# Altium project UD3.1-Zogger-Laptop.PrjPCB
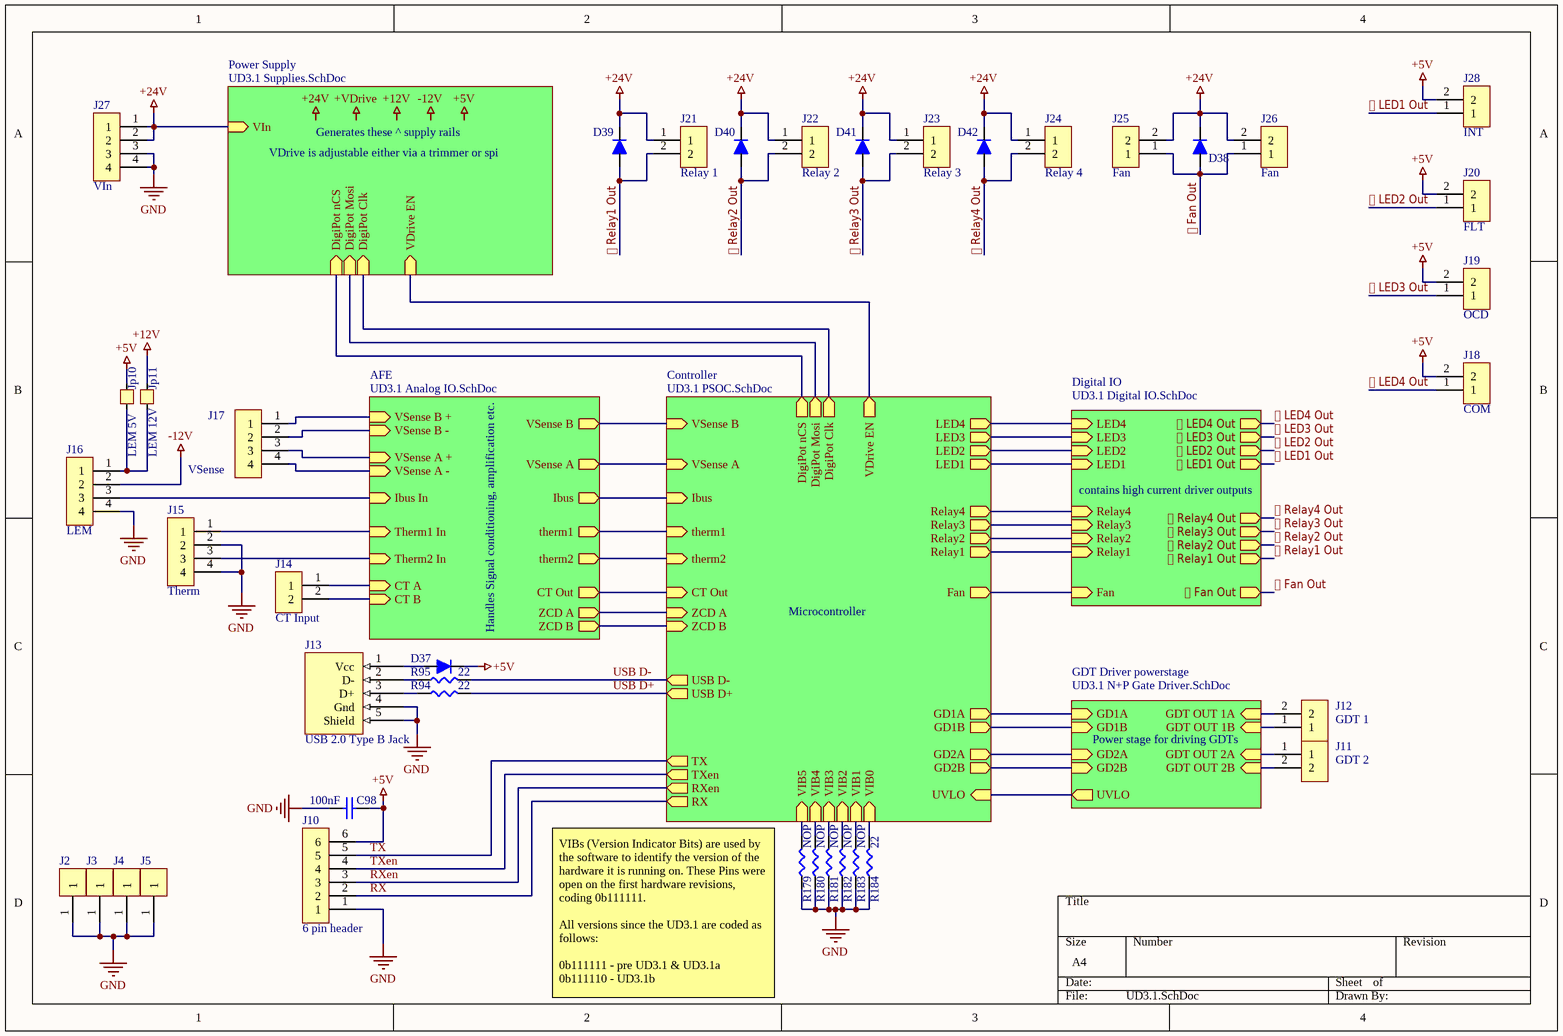
[diagram p0: UD3.1.SchDoc]
ProjectVersion: UD3.1a
6 sheets, 321 parts. Net scope: hierarchical (ports join the sheet entries above them; power ports are global).
Board file: UD3.1.PcbDoc
Sheets:
  UD3.1.SchDoc
    Power Supply = UD3.1 Supplies.SchDoc
    Controller = UD3.1 PSOC.SchDoc
    Digital IO = UD3.1 Digital IO.SchDoc
    GDT Driver powerstage = UD3.1 N+P Gate Driver.SchDoc
    AFE = UD3.1 Analog IO.SchDoc

## Sheet UD3.1.SchDoc
size A4; DocumentNumber: 1; SheetNumber: 1; SheetTotal: 7

### Parts
C98  100nF  [0603]
D37  Schottky 30V 1A  [DO-214]  (value not drawn)
D38  Schottky 30V 1A  [DO-214]  (value not drawn)
D39  Schottky 30V 100mA  [SOD523]  (value not drawn)
D40  Schottky 30V 100mA  [SOD523]  (value not drawn)
D41  Schottky 30V 100mA  [SOD523]  (value not drawn)
D42  Schottky 30V 100mA  [SOD523]  (value not drawn)
J2  GND Pad  [1 Pad M3]  (value not drawn)
J3  GND Pad  [1 Pad M3]  (value not drawn)
J4  GND Pad  [1 Pad M3]  (value not drawn)
J5  GND Pad  [1 Pad M3]  (value not drawn)
J10  6 pin header  [6 KK254 / KF2510]
J11  GDT 2  [2 KK254 / KF2510]
J12  GDT 1  [2 KK254 / KF2510]
J13  USB 2.0 Type B Jack  [USB 2.0 Type B Vertical]
J14  CT Input  [2 KK254 / KF2510]
J15  Therm  [4 KK254 / KF2510]
J16  LEM  [4 KK254 / KF2510]
J17  VSense  [4 KK254 / KF2510]
J18  COM  [2 KK254 / KF2510]
J19  OCD  [2 KK254 / KF2510]
J20  FLT  [2 KK254 / KF2510]
J21  Relay 1  [2 KK254 / KF2510]
J22  Relay 2  [2 KK254 / KF2510]
J23  Relay 3  [2 KK254 / KF2510]
J24  Relay 4  [2 KK254 / KF2510]
J25  Fan  [2 KK254 / KF2510]
J26  Fan  [2 screw terminal vertical]
J27  VIn  [4 KK254 / KF2510]
J28  INT  [2 KK254 / KF2510]
Jp10  LEM 5V  [PCB Jumper NO]
Jp11  LEM 12V  [PCB Jumper NO]
R94  22  [0603]
R95  22  [0603]
R179  NOP  [0603]
R180  NOP  [0603]
R181  NOP  [0603]
R182  NOP  [0603]
R183  NOP  [0603]
R184  22  [0603]

### Sub-sheets
AFE = UD3.1 Analog IO.SchDoc: VSense B + (in), VSense B - (in), VSense A + (in), VSense A - (in), CT A (in), CT B (in), ZCD A (out), ZCD B (out), CT Out (out), Ibus In (in), Ibus (out), Therm1 In (in), therm1 (out), Therm2 In (in), therm2 (out), VSense A (out), VSense B (out)
Controller = UD3.1 PSOC.SchDoc: LED4 (out), LED1 (out), LED2 (out), LED3 (out), Relay1 (out), Relay3 (out), Relay2 (out), Relay4 (out), Fan (out), ZCD A (in), ZCD B (in), CT Out (in), Ibus (in), therm1 (in), therm2 (in), VSense A (in), VSense B (in), DigiPot nCS (out), DigiPot Mosi (out), DigiPot Clk (out), VDrive EN (out), GD1A (out), GD1B (out), GD2A (out), GD2B (out), UVLO (in), USB D- (out), USB D+ (out), RX (out), RXen (out), TXen (out), TX (out), VIB0 (in), VIB1 (in), VIB2 (in), VIB3 (in), VIB4 (in), VIB5 (in)
Digital IO = UD3.1 Digital IO.SchDoc: LED4 (in), ⎐ LED4 Out (out), LED1 (in), LED2 (in), LED3 (in), ⎐ LED3 Out (out), ⎐ LED2 Out (out), ⎐ LED1 Out (out), ⎐ Relay3 Out (out), Relay1 (in), Relay2 (in), Relay3 (in), Relay4 (in), ⎐ Relay1 Out (out), ⎐ Relay2 Out (out), ⎐ Relay4 Out (out), Fan (in), ⎐ Fan Out (out)
GDT Driver powerstage = UD3.1 N+P Gate Driver.SchDoc: GD1A (in), GD1B (in), GD2A (in), GD2B (in), GDT OUT 1A (in), GDT OUT 1B (in), GDT OUT 2A (in), GDT OUT 2B (in), UVLO (out)
Power Supply = UD3.1 Supplies.SchDoc: VIn (in), DigiPot nCS (in), DigiPot Mosi (in), DigiPot Clk (in), VDrive EN (in)

### Nets
+5V: C98.1 D37.2 J10.6 J18.2 J19.2 J20.2 J28.2 Jp10.2
+12V: Jp11.2
+24V: D38.2 D39.2 D40.2 D41.2 D42.2 J21.1 J22.1 J23.1 J24.1 J25.2 J26.2 J27.1 J27.2 ; sheet Power Supply/VIn
-12V: J16.2
GND: C98.2 J2.1 J3.1 J4.1 J5.1 J10.1 J13.4(Gnd) J13.5(Shield) J15.2 J15.4 J16.4 J27.3 J27.4 R179.2 R180.2 R181.2 R182.2 R183.2 R184.2
CTA: J14.1 ; sheet AFE/CT A
CTB: J14.2 ; sheet AFE/CT B
CTout: sheet Controller/CT Out, sheet AFE/CT Out
DigiPot Clk: sheet Power Supply/DigiPot Clk, sheet Controller/DigiPot Clk
DigiPot Mosi: sheet Power Supply/DigiPot Mosi, sheet Controller/DigiPot Mosi
DigiPot nCS: sheet Power Supply/DigiPot nCS, sheet Controller/DigiPot nCS
E3.9: sheet Power Supply/VDrive EN, sheet Controller/VDrive EN
FAN: sheet Controller/Fan, sheet Digital IO/Fan
GD1A: sheet Controller/GD1A, sheet GDT Driver powerstage/GD1A
GD1B: sheet Controller/GD1B, sheet GDT Driver powerstage/GD1B
GD2A: sheet Controller/GD2A, sheet GDT Driver powerstage/GD2A
GD2B: sheet Controller/GD2B, sheet GDT Driver powerstage/GD2B
Ibus: sheet Controller/Ibus, sheet AFE/Ibus
LED1: sheet Controller/LED1, sheet Digital IO/LED1
LED2: sheet Controller/LED2, sheet Digital IO/LED2
LED3: sheet Controller/LED3, sheet Digital IO/LED3
LED4: sheet Controller/LED4, sheet Digital IO/LED4
Relay1: sheet Controller/Relay1, sheet Digital IO/Relay1
Relay2: sheet Controller/Relay2, sheet Digital IO/Relay2
Relay3: sheet Controller/Relay3, sheet Digital IO/Relay3
Relay4: sheet Controller/Relay4, sheet Digital IO/Relay4
RX: J10.2 ; sheet Controller/RX
RXen: J10.3 ; sheet Controller/RXen
therm1: sheet Controller/therm1, sheet AFE/therm1
therm2: sheet Controller/therm2, sheet AFE/therm2
TX: J10.5 ; sheet Controller/TX
TXen: J10.4 ; sheet Controller/TXen
USB D+: R94.1 ; sheet Controller/USB D+
USB D-: R95.1 ; sheet Controller/USB D-
UVLO: sheet Controller/UVLO, sheet GDT Driver powerstage/UVLO
VSense A: sheet Controller/VSense A, sheet AFE/VSense A
VSense B: sheet Controller/VSense B, sheet AFE/VSense B
ZCDA: sheet Controller/ZCD A, sheet AFE/ZCD A
ZCDB: sheet Controller/ZCD B, sheet AFE/ZCD B
⎐ Fan Out: D38.1 J25.1 J26.1 ; sheet Digital IO/⎐ Fan Out
⎐ LED1 Out: J28.1 ; sheet Digital IO/⎐ LED1 Out
⎐ LED2 Out: J20.1 ; sheet Digital IO/⎐ LED2 Out
⎐ LED3 Out: J19.1 ; sheet Digital IO/⎐ LED3 Out
⎐ LED4 Out: J18.1 ; sheet Digital IO/⎐ LED4 Out
⎐ Relay1 Out: D39.1 J21.2 ; sheet Digital IO/⎐ Relay1 Out  [project net Relay1 Out]
⎐ Relay2 Out: D40.1 J22.2 ; sheet Digital IO/⎐ Relay2 Out  [project net Relay2 Out]
⎐ Relay3 Out: D41.1 J23.2 ; sheet Digital IO/⎐ Relay3 Out  [project net Relay3 Out]
⎐ Relay4 Out: D42.1 J24.2 ; sheet Digital IO/⎐ Relay4 Out  [project net Relay4 Out]
NetC84_1: J17.4 ; sheet AFE/VSense A -
NetC85_2: J17.3 ; sheet AFE/VSense A +
NetC88_2: J15.3 ; sheet AFE/Therm2 In
NetC92_2: J17.1 ; sheet AFE/VSense B +
NetC94_2: J17.2 ; sheet AFE/VSense B -
NetC95_2: J15.1 ; sheet AFE/Therm1 In
NetC100_2: J11.2 ; sheet GDT Driver powerstage/GDT OUT 2B
NetC102_2: J11.1 ; sheet GDT Driver powerstage/GDT OUT 2A
NetC116_2: J12.1 ; sheet GDT Driver powerstage/GDT OUT 1B
NetC118_2: J12.2 ; sheet GDT Driver powerstage/GDT OUT 1A
NetD37_1: D37.1 J13.1(Vcc)
NetJ13_2: J13.2(D-) R95.2
NetJ13_3: J13.3(D+) R94.2
NetJ16_1: J16.1 Jp10.1 Jp11.1
NetJ16_3: J16.3 ; sheet AFE/Ibus In
NetR179_1: R179.1 ; sheet Controller/VIB5
NetR180_1: R180.1 ; sheet Controller/VIB4
NetR181_1: R181.1 ; sheet Controller/VIB3
NetR182_1: R182.1 ; sheet Controller/VIB2
NetR183_1: R183.1 ; sheet Controller/VIB1
NetR184_1: R184.1 ; sheet Controller/VIB0

### Notes on the sheet
- VDrive is adjustable either via a trimmer or spi
- Generates these ^ supply rails
- contains high current driver outputs
- Handles Signal conditioning, amplification etc.
- Microcontroller
- Power stage for driving GDTs
- VIBs (Version Indicator Bits) are used by the software to identify the version of the hardware it is running on. These Pins were open on the first hardware revisions, coding 0b111111.
  All versions since the UD3.1 are coded as follows:
  0b111111 - pre UD3.1 & UD3.1a
  0b111110 - UD3.1b
- Labels drawn without touching a wire or pin: +5V, +12V, +24V, +VDrive, -12V

### Library data of the parts
C98 = Cap
D37-D42 = Diode: Cmon its a diode what more do I need to say?; pin to pad: 1>2 2>1; Supplier 1: Digi-Key; Supplier Part Number 1: MBR10100GOS-ND; Supplier 2: Digi-Key; Supplier Part Number 2: 1655-1504-1-ND
J2-J5 = 1 Header
J10 = 6 header
J11 J12 J14 J18-J25 J28 = 2 header
J13 = USB 2.0 Type B
J15-J17 J27 = 4 header
J26 = 2 screw terminal
Jp10 Jp11 = Jumper
R94 R95 R179-R184 = Resistor

## Sheet UD3.1 Supplies.SchDoc
size A4; DocumentNumber: 2; SheetNumber: 2; SheetTotal: 7
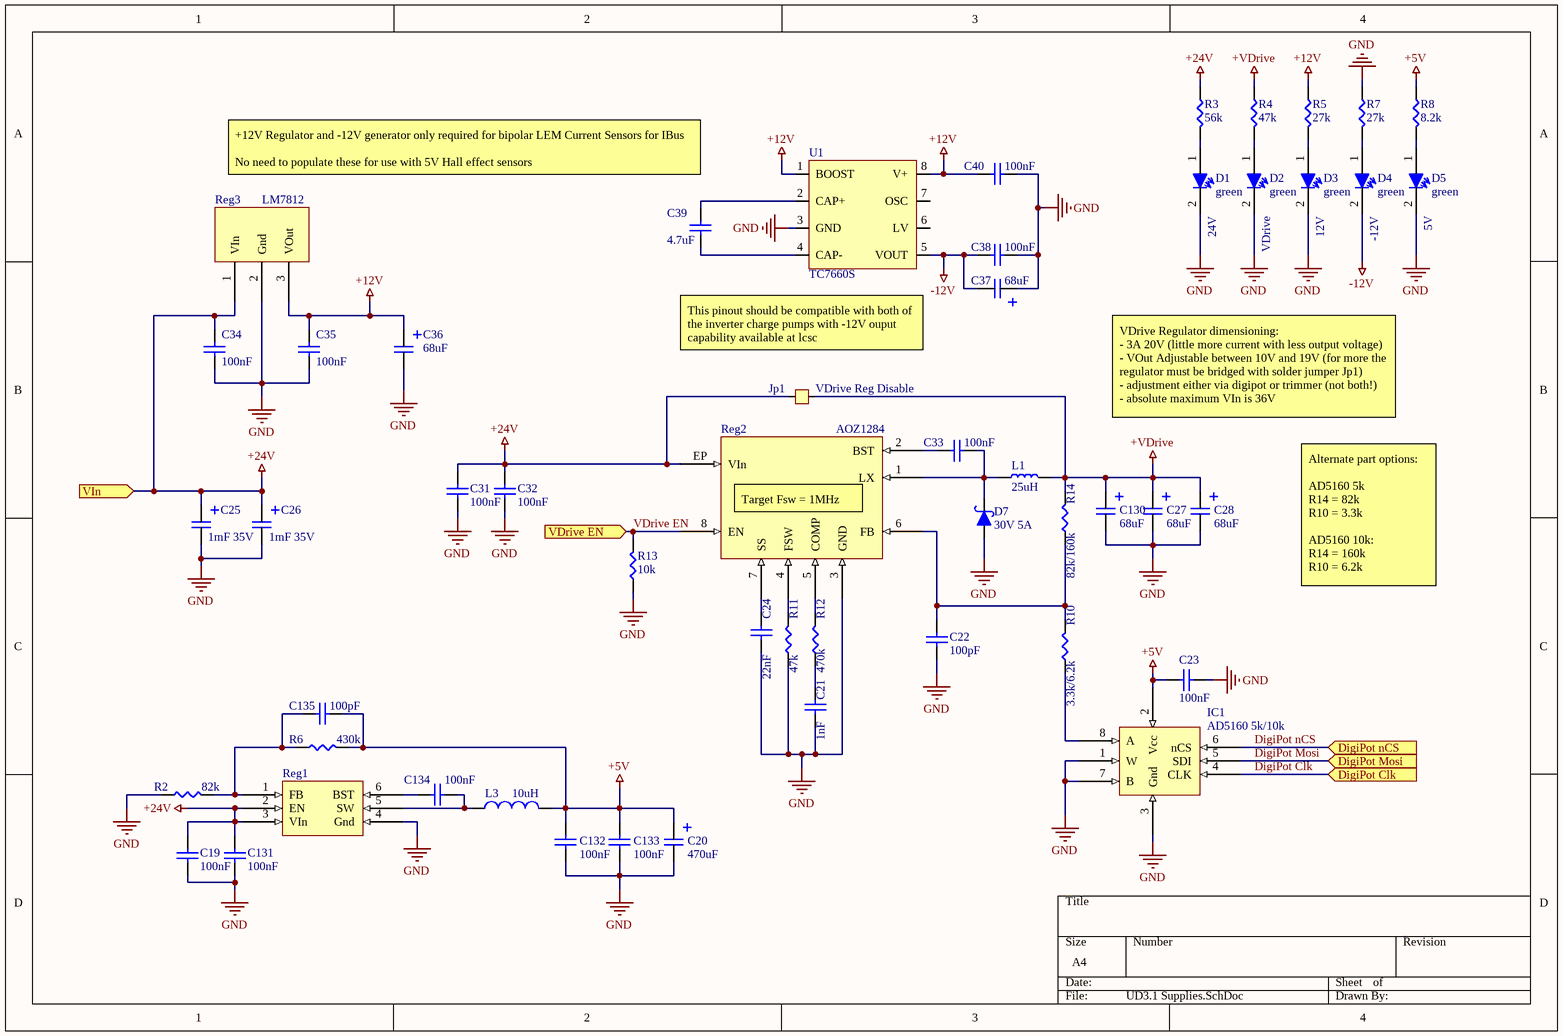
[diagram p1: UD3.1 Supplies.SchDoc]

### Parts
C19  100nF  [0603]
C20  470uF  [Elko 6,3 x 11 x 2,5]
C21  1nF  [0603]
C22  100pF  [0603]
C23  100nF  [0603]
C24  22nF  [0603]
C25  1mF 35V  [Elko 13 x 25 x 5]
C26  1mF 35V  [Elko 13 x 25 x 5]
C27  68uF  [Elko 6,3 x 11 x 2,5]
C28  68uF  [Elko 6,3 x 11 x 2,5]
C31  100nF  [0603]
C32  100nF  [0603]
C33  100nF  [0603]
C34  100nF  [0603]
C35  100nF  [0603]
C36  68uF  [Elko 6,3 x 11 x 2,5]
C37  68uF  [Elko 6,3 x 11 x 2,5]
C38  100nF  [0603]
C39  4.7uF  [0603]
C40  100nF  [0603]
C130  68uF  [Elko 6,3 x 11 x 2,5]
C131  100nF  [0603]
C132  100nF  [0603]
C133  100nF  [0603]
C134  100nF  [0603]
C135  100pF  [0603]
D1  green  [1206 Reverse Mount]
D2  green  [1206 Reverse Mount]
D3  green  [1206 Reverse Mount]
D4  green  [1206 Reverse Mount]
D5  green  [1206 Reverse Mount]
D7  30V 5A  [DO-214]
IC1  AD5160 5k/10k  [Sot 23-8]
Jp1  VDrive Reg Disable  [PCB Jumper NO]
L1  25uH  [Inductor 11x11mm]
L3  10uH  [1008]
R2  82k  [0603]
R3  56k  [0603]
R4  47k  [0603]
R5  27k  [0603]
R6  430k  [0603]
R7  27k  [0603]
R8  8.2k  [0603]
R10  3.3k/6.2k  [0603]
R11  47k  [0603]
R12  470k  [0603]
R13  10k  [0603]
R14  82k/160k  [0603]
Reg1  Buck regulator  [TSOT26]  (value not drawn)
Reg2  AOZ1284  [SOIC8 EXPOSED]
Reg3  LM7812  [TO252 DPAk]
U1  TC7660S  [SOIC8]

### Ports
DigiPot Clk (in), DigiPot Mosi (in), DigiPot nCS (in), VDrive EN (in), VIn (in)

### Nets
+5V: C20.1 C23.2 C132.1 C133.1 C135.1 IC1.2(Vcc) L3.2 R6.2 R8.1
+12V: C35.2 C36.1 C40.2 R5.1 Reg3.3(VOut) U1.1(BOOST) U1.8(V+)
+24V: C19.2 C25.1 C26.1 C31.2 C32.2 C34.2 C131.1 Jp1.1 R3.1 Reg1.2(EN) Reg1.3(VIn) Reg2.EP(VIn) Reg3.1(VIn) ; port VIn
+VDrive: C27.1 C28.1 C130.1 Jp1.2 L1.2 R4.1 R14.2
-12V: C37.2 C38.2 D4.2 U1.5(VOUT)
GND: C19.1 C20.2 C21.1 C22.2 C23.1 C24.1 C25.2 C26.2 C27.2 C28.2 C31.1 C32.1 C34.1 C35.1 C36.2 C37.1 C38.1 C40.1 C130.2 C131.2 C132.2 C133.2 D1.2 D2.2 D3.2 D5.2 D7.1 IC1.1(W) IC1.3(Gnd) IC1.7(B) R2.1 R7.1 R11.1 R13.1 Reg1.4(Gnd) Reg2.3(GND) Reg3.2(Gnd) U1.3(GND)
DigiPot Clk: IC1.4(CLK) ; port DigiPot Clk
DigiPot Mosi: IC1.5(SDI) ; port DigiPot Mosi
DigiPot nCS: IC1.6(nCS) ; port DigiPot nCS
VDrive EN: R13.2 Reg2.8(EN) ; port VDrive EN  [project net E3.9]
NetC21_2: C21.2 R12.1
NetC22_1: C22.1 R10.2 R14.1 Reg2.6(FB)
NetC24_2: C24.2 Reg2.7(SS)
NetC33_1: C33.1 D7.2 L1.1 Reg2.1(LX)
NetC33_2: C33.2 Reg2.2(BST)
NetC39_1: C39.1 U1.2(CAP+)
NetC39_2: C39.2 U1.4(CAP-)
NetC134_1: C134.1 Reg1.6(BST)
NetC134_2: C134.2 L3.1 Reg1.5(SW)
NetC135_2: C135.2 R2.2 R6.1 Reg1.1(FB)
NetD1_1: D1.1 R3.2
NetD2_1: D2.1 R4.2
NetD3_1: D3.1 R5.2
NetD4_1: D4.1 R7.2
NetD5_1: D5.1 R8.2
NetIC1_8: IC1.8(A) R10.1
NetR11_2: R11.2 Reg2.4(FSW)
NetR12_2: R12.2 Reg2.5(COMP)

Not connected (* = marked no-connect by the designer): U1 6(LV) 7(OSC)

### Notes on the sheet
- (near C39) +12V Regulator and -12V generator only required for bipolar LEM Current Sensors for IBus
  No need to populate these for use with 5V Hall effect sensors
- 24V
- VDrive
- 12V
- -12V
- (near D5) 5V
- This pinout should be compatible with both of the inverter charge pumps with -12V ouput capability available at lcsc
- VDrive Regulator dimensioning:
  - 3A 20V (little more current with less output voltage)
  - VOut Adjustable between 10V and 19V (for more the regulator must be bridged with solder jumper Jp1)
  - adjustment either via digipot or trimmer (not both!)
  - absolute maximum VIn is 36V
- (near Reg2) Target Fsw = 1MHz
- Alternate part options:
  AD5160 5k
  R14 = 82k
  R10 = 3.3k
  AD5160 10k:
  R14 = 160k
  R10 = 6.2k

### Library data of the parts
C19 C21-C24 C31-C35 C38-C40 C131-C135 = Cap
  C19 C131-C135: Supplier 1: Digi-Key; Supplier 2: Digi-Key; Supplier 3: Digi-Key; Supplier Part Number 1: 1276-2044-1-ND; Supplier Part Number 2: 1276-1018-1-ND; Supplier Part Number 3: 1276-1182-1-ND; Supplier 4: Digi-Key; Supplier 5: Digi-Key; Supplier 6: Digi-Key; Supplier 7: Digi-Key; Supplier 8: Digi-Key; Supplier 9: Digi-Key; Supplier Part Number 4: 1276-1009-1-ND; Supplier Part Number 5: 1276-1098-1-ND; Supplier Part Number 6: 1276-1119-1-ND; Supplier Part Number 7: 490-12737-1-ND; Supplier Part Number 9: 587-1249-1-ND; Supplier Part Number 8: 1276-1183-1-ND; Supplier 10: Digi-Key; Supplier 11: Digi-Key; Supplier 12: Digi-Key; Supplier 13: Digi-Key; Supplier Part Number 10: 1276-CL10B104KB8NNNLCT-ND; Supplier Part Number 11: 399-1085-1-ND; Supplier Part Number 13: 587-2985-1-ND; Supplier Part Number 12: 1276-1021-1-ND; Supplier 14: Digi-Key; Supplier 15: Digi-Key; Supplier 16: Digi-Key; Supplier 17: Digi-Key; Supplier 18: Digi-Key; Supplier 19: Digi-Key; Supplier Part Number 14: 490-14603-1-ND; Supplier Part Number 15: 311-3700-1-ND; Supplier Part Number 16: 311-1042-1-ND; Supplier Part Number 17: 311-1415-1-ND; Supplier Part Number 19: 587-4321-1-ND; Supplier Part Number 18: 1276-1907-1-ND; Supplier 20: Digi-Key; Supplier 21: Digi-Key; Supplier 22: Digi-Key; Supplier Part Number 20: 1276-6767-1-ND; Supplier Part Number 21: 1276-7060-1-ND; Supplier Part Number 22: 311-1084-1-ND
C20 C25-C28 C36 C37 C130 = Cap Polar: Supplier 1: Digi-Key; Supplier Part Number 1: 478-9181-1-ND; Supplier 2: Digi-Key; Supplier 3: Digi-Key; Supplier Part Number 2: 478-9173-1-ND; Supplier Part Number 3: 493-11037-ND; Supplier 4: Digi-Key; Supplier 5: Digi-Key; Supplier Part Number 4: PCE3462CT-ND; Supplier Part Number 5: 399-18864-1-ND; Supplier 6: Digi-Key; Supplier Part Number 6: 399-10512-1-ND; Supplier 7: Digi-Key; Supplier Part Number 7: 399-15746-ND; Supplier 8: Digi-Key; Supplier Part Number 8: 1189-3752-1-ND
D1-D5 = LED: Diode, but it lights up; Supplier 1: Digi-Key; Supplier 2: Digi-Key; Supplier 3: Digi-Key; Supplier 4: Digi-Key; Supplier Part Number 1: 732-4979-1-ND; Supplier Part Number 2: 732-4971-1-ND; Supplier Part Number 3: 732-4966-1-ND; Supplier Part Number 4: 732-4981-1-ND
D7 = Diode Schottky: pin to pad: 1>2 2>1; Supplier 1: Digi-Key; Supplier Part Number 1: FSV12100VCT-ND
IC1 = AD5160: DigiPot 8bit
Jp1 = Jumper
L1 = Inductor High Power: Supplier 1: Digi-Key; Supplier Part Number 1: 541-1253-1-ND; Supplier 2: Digi-Key; Supplier Part Number 2: SRP1265A-1R0MCT-ND; Supplier 3: Digi-Key; Supplier Part Number 3: 732-4237-1-ND
L3 = Inductor: Supplier 1: Digi-Key; Supplier 2: Digi-Key; Supplier Part Number 1: 541-1250-1-ND; Supplier Part Number 2: 541-1253-1-ND; Supplier 3: Digi-Key; Supplier 4: Digi-Key; Supplier Part Number 3: SRN6028-3R9MCT-ND; Supplier Part Number 4: SRN6028-4R7MCT-ND; Supplier 5: Digi-Key; Supplier 6: Digi-Key; Supplier 7: Digi-Key; Supplier 8: Digi-Key; Supplier 9: Digi-Key; Supplier 10: Digi-Key; Supplier 11: Digi-Key; Supplier Part Number 5: 490-10563-1-ND; Supplier Part Number 6: 1276-6932-1-ND; Supplier Part Number 7: 587-2042-1-ND; Supplier Part Number 8: 535-12790-1-ND; Supplier Part Number 9: SRP1265A-1R0MCT-ND; Supplier Part Number 10: SRP1770TA-5R6MCT-ND; Supplier Part Number 11: SRN6028-100MCT-ND
R2-R8 R10-R14 = Resistor
Reg1 = AP6320: Supplier 1: Digi-Key; Supplier Part Number 1: AP63203WU-7DICT-ND; Supplier 2: Digi-Key; Supplier Part Number 2: AP63200WU-7DICT-ND; Supplier 3: Digi-Key; Supplier Part Number 3: AP63201WU-7DICT-ND
Reg2 = AOZ1284: Buck Regulator, Internal Switch 4A
Reg3 = lm78xx: positive voltage regulator

## Sheet UD3.1 PSOC.SchDoc
size A4; DocumentNumber: 3; SheetNumber: 3; SheetTotal: 7; PageSetup: Record=PageOptions|CenterHorizontal=True|CenterVertical=True|PrintScale=0.54|XCorrection=1.00|YCorrection=1.00|PrintKind=0|BorderSize=5000000|LeftOffset=0|BottomOffset=0|Orientation=2|PaperLength=1000|PaperWidth=1000|Scale=100|PaperSource=7|PrintQuality=-4|MediaType=1|DitherType=10|PaperKind=Letter|PrintScaleMode=1
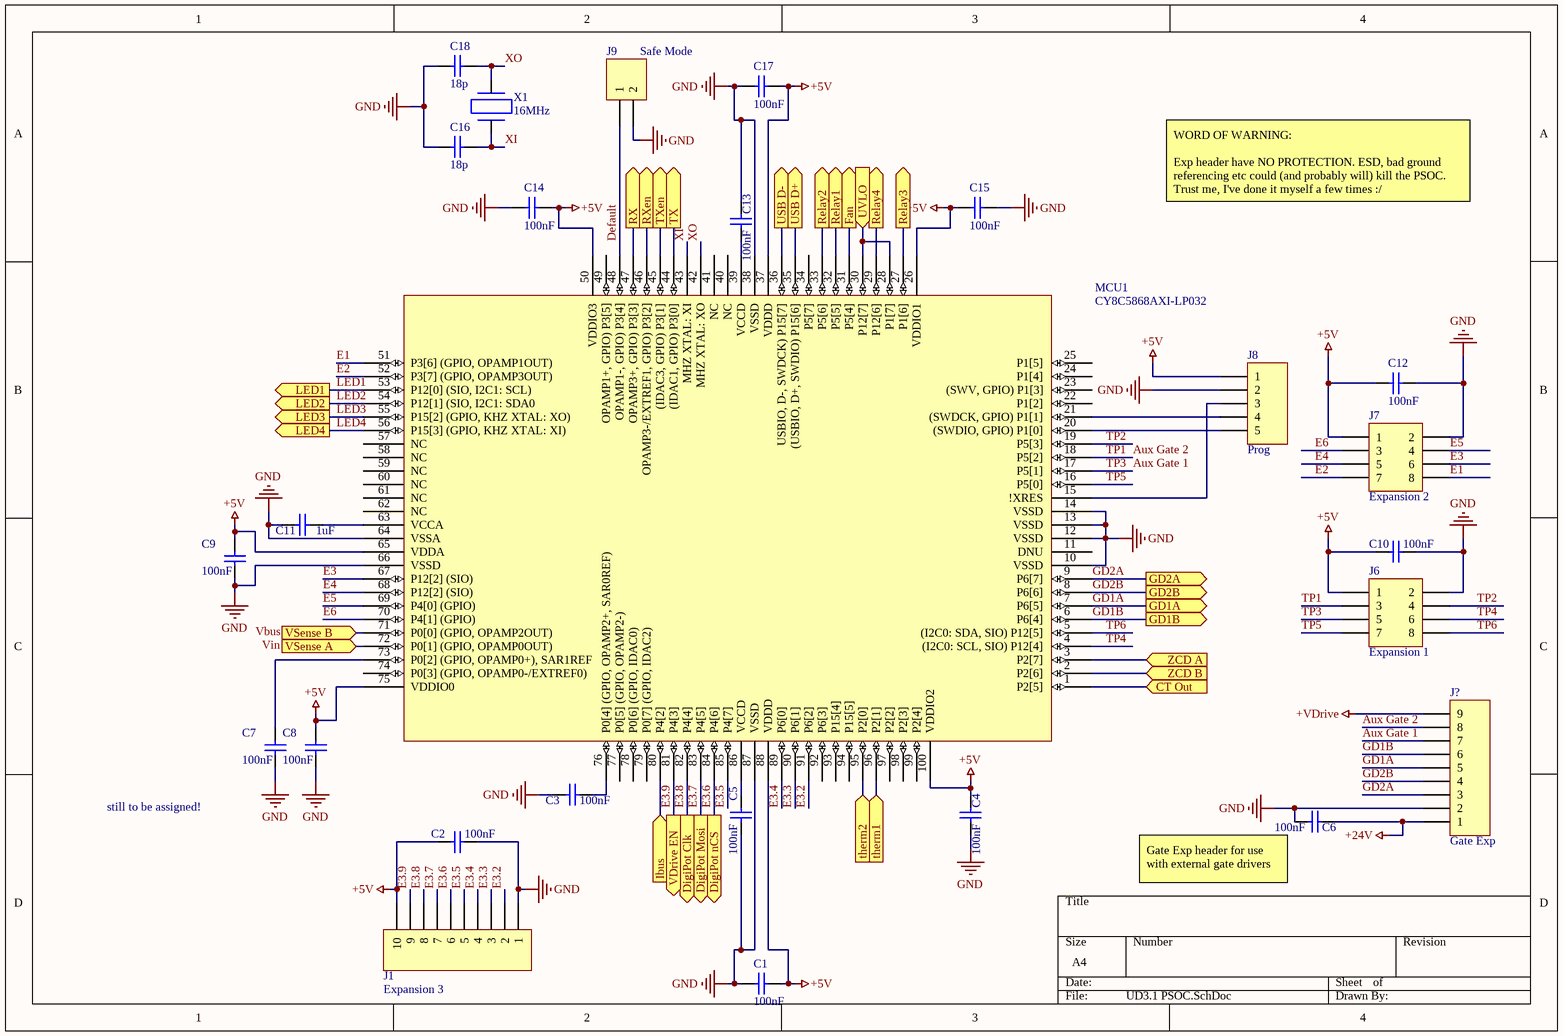
[diagram p2: UD3.1 PSOC.SchDoc]

### Parts
C1  100nF  [0603]
C2  100nF  [0603]
C3  100nF  [0603]
C4  100nF  [0603]
C5  100nF  [0603]
C6  100nF  [0805]
C7  100nF  [0603]
C8  100nF  [0603]
C9  100nF  [0603]
C10  100nF  [0603]
C11  1uF  [0603]
C12  100nF  [0603]
C13  100nF  [0603]
C14  100nF  [0603]
C15  100nF  [0603]
C16  18p  [0603]
C17  100nF  [0603]
C18  18p  [0603]
J1  Expansion 3  [HDR1X10]
J6  Expansion 1  [HDR2X4]
J7  Expansion 2  [HDR2X4]
J8  Prog  [HDR1X5]
J9  Safe Mode  [HDR1X2]
J?  Gate Exp  [HDR1X9]
MCU1  CY8C5868AXI-LP032  [TQFP 100]
X1  16MHz  [ECS-3225MV Oscillator]

### Ports
CT Out (in), DigiPot Clk (out), DigiPot Mosi (out), DigiPot nCS (out), Fan (out), GD1A (out), GD1B (out), GD2A (out), GD2B (out), Ibus (in), LED1 (out), LED2 (out), LED3 (out), LED4 (out), Relay1 (out), Relay2 (out), Relay3 (out), Relay4 (out), RX (out), RXen (out), therm1 (in), therm2 (in), TX (out), TXen (out), USB D+ (out), USB D- (out), UVLO (in), VDrive EN (out), VSense A (in), VSense B (in), ZCD A (in), ZCD B (in)

### Nets
+5V: C1.2 C2.1 C4.2 C8.2 C9.2 C10.1 C12.2 C14.2 C15.2 C17.2 J1.10 J6.1 J7.1 J8.1 MCU1.26(VDDIO1) MCU1.37(VDDD) MCU1.50(VDDIO3) MCU1.65(VDDA) MCU1.75(VDDIO0) MCU1.88(VDDD) MCU1.100(VDDIO2)
+24V: C6.2 J?.1
+VDrive: J?.9
GND: C1.1 C2.2 C3.1 C4.1 C5.1 C6.1 C7.1 C8.1 C9.1 C10.2 C11.1 C12.1 C13.1 C14.1 C15.1 C16.2 C17.1 C18.2 J1.1 J6.2 J7.2 J8.2 J9.2 J?.2 MCU1.10(VSSD) MCU1.12(VSSD) MCU1.13(VSSD) MCU1.14(VSSD) MCU1.38(VSSD) MCU1.64(VSSA) MCU1.66(VSSD) MCU1.87(VSSD)
Aux Gate 1: J6.5 J?.7 MCU1.17(P5[1])  [also labelled TP3]
Aux Gate 2: J6.3 J?.8 MCU1.18(P5[2])  [also labelled TP1]
CTout: MCU1.1(P2[5]) ; port CT Out
Default: J9.1 MCU1.48(OPAMP1-,_GPIO)_P3[4])
E1: J7.8 MCU1.51(P3[6]_(GPIO,_OPAMP1OUT))
E2: J7.7 MCU1.52(P3[7]_(GPIO,_OPAMP3OUT))
E3: J7.6 MCU1.67(P12[2]_(SIO))
E3.2: J1.2 MCU1.91(P6[2])
E3.3: J1.3 MCU1.90(P6[1])
E3.4: J1.4 MCU1.89(P6[0])
E3.5: J1.5 MCU1.85(P4[7])
E3.6: J1.6 MCU1.84(P4[6]) ; port DigiPot nCS  [project net DigiPot nCS]
E3.7: J1.7 MCU1.83(P4[5]) ; port DigiPot Mosi  [project net DigiPot Mosi]
E3.8: J1.8 MCU1.82(P4[4]) ; port DigiPot Clk  [project net DigiPot Clk]
E3.9: J1.9 MCU1.81(P4[3]) ; port VDrive EN
E4: J7.5 MCU1.68(P12[2]_(SIO))
E5: J7.4 MCU1.69(P4[0]_(GPIO))
E6: J7.3 MCU1.70(P4[1]_(GPIO))
FAN: MCU1.31(P5[4]) ; port Fan
GD1A: J?.5 MCU1.7(P6[5]) ; port GD1A
GD1B: J?.6 MCU1.6(P6[4]) ; port GD1B
GD2A: J?.3 MCU1.9(P6[7]) ; port GD2A
GD2B: J?.4 MCU1.8(P6[6]) ; port GD2B
Ibus: MCU1.80(P4[2]) ; port Ibus
LED1: MCU1.53(P12[0]_(SIO,_I2C1:_SCL)) ; port LED1
LED2: MCU1.54(P12[1]_(SIO,_I2C1:_SDA0) ; port LED2
LED3: MCU1.55(P15[2]_(GPIO,_KHZ_XTAL:_XO)) ; port LED3
LED4: MCU1.56(P15[3]_(GPIO,_KHZ_XTAL:_XI)) ; port LED4
Relay1: MCU1.32(P5[5]) ; port Relay1
Relay2: MCU1.33(P5[6]) ; port Relay2
Relay3: MCU1.27(P1[6]) ; port Relay3
Relay4: MCU1.29(P12[6]) ; port Relay4
RX: MCU1.47(OPAMP3+,_GPIO)_P3[3]) ; port RX
RXen: MCU1.46(OPAMP3-/EXTREF1,_GPIO)_P3[2]) ; port RXen
therm1: MCU1.96(P2[1]) ; port therm1
therm2: MCU1.95(P2[0]) ; port therm2
TP2: J6.4 MCU1.19(P5[3])
TP4: J6.6 MCU1.4((I2C0:_SCL,_SIO)_P12[4])
TP5: J6.7 MCU1.16(P5[0])
TP6: J6.8 MCU1.5((I2C0:_SDA,_SIO)_P12[5])
TX: MCU1.44((IDAC1,_GPIO)_P3[0]) ; port TX
TXen: MCU1.45((IDAC3,_GPIO)_P3[1]) ; port TXen
USB D+: MCU1.35((USBIO,_D+,_SWDIO)_P15[6]) ; port USB D+
USB D-: MCU1.36(USBIO,_D-,_SWDCK)_P15[7]) ; port USB D-
UVLO: MCU1.28(P1[7]) MCU1.30(P12[7]) ; port UVLO
VSense A: MCU1.72(P0[1]_(GPIO,_OPAMP0OUT)) ; port VSense A
VSense B: MCU1.71(P0[0]_(GPIO,_OPAMP2OUT)) ; port VSense B
XI: C16.1 MCU1.43(MHZ_XTAL:_XI) X1.2
XO: C18.1 MCU1.42(MHZ_XTAL:_XO) X1.1
ZCDA: MCU1.3(P2[7]) ; port ZCD A
ZCDB: MCU1.2(P2[6]) ; port ZCD B
NetC3_2: C3.2 MCU1.76(P0[4]_(GPIO,_OPAMP2+,_SAR0REF))
NetC5_2: C5.2 MCU1.86(VCCD)
NetC7_2: C7.2 MCU1.73(P0[2]_(GPIO,_OPAMP0+),_SAR1REF)
NetC11_2: C11.2 MCU1.63(VCCA)
NetC13_2: C13.2 MCU1.39(VCCD)
NetJ8_3: J8.3 MCU1.15(!XRES)
NetJ8_4: J8.4 MCU1.21((SWDCK,_GPIO)_P1[1])
NetJ8_5: J8.5 MCU1.20((SWDIO,_GPIO)_P1[0])

Not connected (* = marked no-connect by the designer): MCU1 11(DNU) 22(P1[2]) 23((SWV,_GPIO)_P1[3]) 24(P1[4]) 25(P1[5]) 34(P5[7]) 40(NC) 41(NC) 49(OPAMP1+,_GPIO)_P3[5]) 57(NC) 58(NC) 59(NC) 60(NC) 61(NC) 62(NC) 74(P0[3]_(GPIO,_OPAMP0-/EXTREF0)) 77(P0[5]_(GPIO,_OPAMP2-)) 78(P0[6]_(GPIO,_IDAC0)) 79(P0[7]_(GPIO,_IDAC2)) 92(P6[3]) 93(P15[4]) 94(P15[5]) 97(P2[2]) 98(P2[3]) 99(P2[4])

### Notes on the sheet
- WORD OF WARNING:
  Exp header have NO PROTECTION. ESD, bad ground referencing etc could (and probably will) kill the PSOC. Trust me, I've done it myself a few times :/
- still to be assigned!
- (near C6) Gate Exp header for use with external gate drivers
- Labels drawn without touching a wire or pin: Vbus, Vin

### Library data of the parts
C1-C18 = Cap
J1 = Header 10: Header, 10-Pin; LatestRevisionDate: 17-Jul-2002; LatestRevisionNote: Re-released for DXP Platform.; Publisher: Altium Limited
J6 J7 = Header 4X2: Header, 4-Pin, Dual row; LatestRevisionDate: 17-Jul-2002; LatestRevisionNote: Re-released for DXP Platform.; Publisher: Altium Limited
J8 = Header 5: Header, 5-Pin; LatestRevisionDate: 17-Jul-2002; LatestRevisionNote: Re-released for DXP Platform.; Publisher: Altium Limited
J9 = Header 2: Header, 2-Pin; LatestRevisionDate: 17-Jul-2002; LatestRevisionNote: Re-released for DXP Platform.; Publisher: Altium Limited
J? = Header 9: Header, 9-Pin; LatestRevisionDate: 17-Jul-2002; LatestRevisionNote: Re-released for DXP Platform.; Publisher: Altium Limited
MCU1 = CY8C5466AXI-064
X1 = Quarz crystal: pin to pad: 1>2 2>4; Supplier 1: Digi-Key; Supplier Part Number 1: SER4069TR-ND

## Sheet UD3.1 Digital IO.SchDoc
size A4; DocumentNumber: 5; SheetNumber: 5; SheetTotal: 7
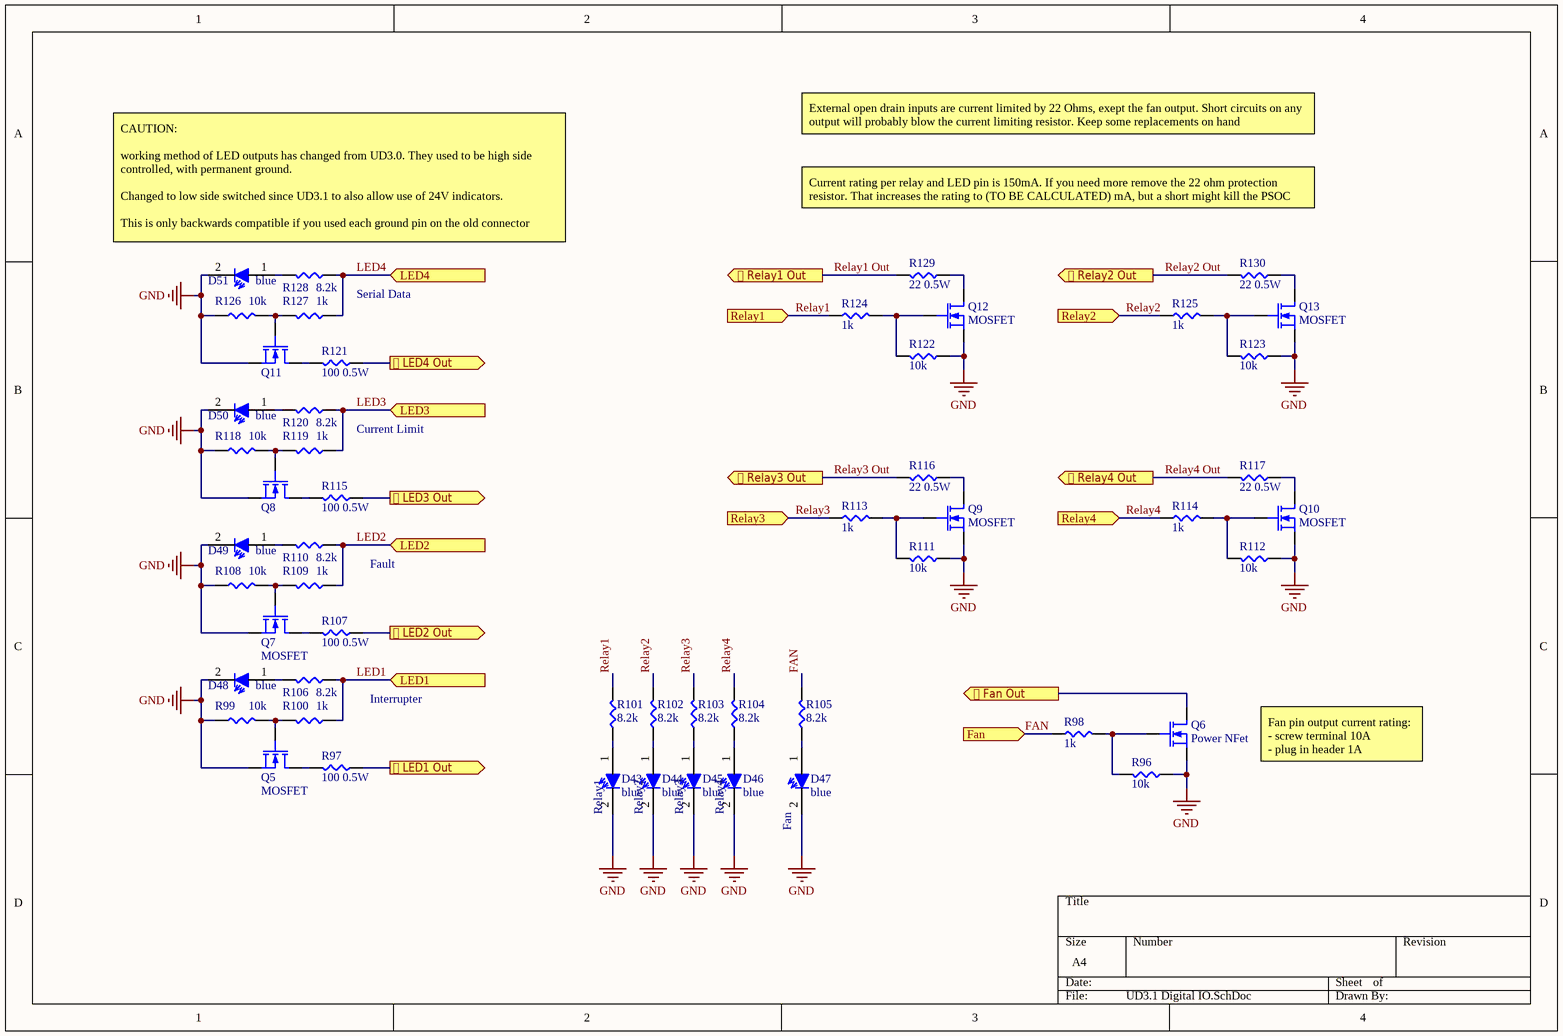
[diagram p3: UD3.1 Digital IO.SchDoc]

### Parts
D43  blue  [1206 Reverse Mount]
D44  blue  [1206 Reverse Mount]
D45  blue  [1206 Reverse Mount]
D46  blue  [1206 Reverse Mount]
D47  blue  [1206 Reverse Mount]
D48  blue  [1206 Reverse Mount]
D49  blue  [1206 Reverse Mount]
D50  blue  [1206 Reverse Mount]
D51  blue  [1206 Reverse Mount]
Q5  MOSFET  [sot 23]
Q6  Power NFet  [SOIC8]
Q7  MOSFET  [sot 23]
Q8  MOSFET  [sot 23]  (value not drawn)
Q9  MOSFET  [sot 23]
Q10  MOSFET  [sot 23]
Q11  MOSFET  [sot 23]  (value not drawn)
Q12  MOSFET  [sot 23]
Q13  MOSFET  [sot 23]
R96  10k  [0603]
R97  100 0.5W  [1206]
R98  1k  [0603]
R99  10k  [0603]
R100  1k  [0603]
R101  8.2k  [0603]
R102  8.2k  [0603]
R103  8.2k  [0603]
R104  8.2k  [0603]
R105  8.2k  [0603]
R106  8.2k  [0603]
R107  100 0.5W  [1206]
R108  10k  [0603]
R109  1k  [0603]
R110  8.2k  [0603]
R111  10k  [0603]
R112  10k  [0603]
R113  1k  [0603]
R114  1k  [0603]
R115  100 0.5W  [1206]
R116  22 0.5W  [1206]
R117  22 0.5W  [1206]
R118  10k  [0603]
R119  1k  [0603]
R120  8.2k  [0603]
R121  100 0.5W  [1206]
R122  10k  [0603]
R123  10k  [0603]
R124  1k  [0603]
R125  1k  [0603]
R126  10k  [0603]
R127  1k  [0603]
R128  8.2k  [0603]
R129  22 0.5W  [1206]
R130  22 0.5W  [1206]

### Ports
Fan (in), LED1 (in), LED2 (in), LED3 (in), LED4 (in), Relay1 (in), Relay2 (in), Relay3 (in), Relay4 (in), ⎐ Fan Out (out), ⎐ LED1 Out (out), ⎐ LED2 Out (out), ⎐ LED3 Out (out), ⎐ LED4 Out (out), ⎐ Relay1 Out (out), ⎐ Relay2 Out (out), ⎐ Relay3 Out (out), ⎐ Relay4 Out (out)

### Nets
GND: D43.2 D44.2 D45.2 D46.2 D47.2 D48.2 D49.2 D50.2 D51.2 Q5.S Q6.S Q7.S Q8.S Q9.S Q10.S Q11.S Q12.S Q13.S R96.1 R99.1 R108.1 R111.1 R112.1 R118.1 R122.1 R123.1 R126.1
FAN: R98.1 R105.1 ; port Fan
LED1: R100.1 R106.1 ; port LED1
LED2: R109.1 R110.1 ; port LED2
LED3: R119.1 R120.1 ; port LED3
LED4: R127.1 R128.1 ; port LED4
Relay1: R101.1 R124.1 ; port Relay1
Relay1 Out: R129.2 ; port ⎐ Relay1 Out
Relay2: R102.1 R125.1 ; port Relay2
Relay2 Out: R130.2 ; port ⎐ Relay2 Out
Relay3: R103.1 R113.1 ; port Relay3
Relay3 Out: R116.2 ; port ⎐ Relay3 Out
Relay4: R104.1 R114.1 ; port Relay4
Relay4 Out: R117.2 ; port ⎐ Relay4 Out
⎐ Fan Out: Q6.D ; port ⎐ Fan Out
⎐ LED1 Out: R97.1 ; port ⎐ LED1 Out
⎐ LED2 Out: R107.1 ; port ⎐ LED2 Out
⎐ LED3 Out: R115.1 ; port ⎐ LED3 Out
⎐ LED4 Out: R121.1 ; port ⎐ LED4 Out
NetD43_1: D43.1 R101.2
NetD44_1: D44.1 R102.2
NetD45_1: D45.1 R103.2
NetD46_1: D46.1 R104.2
NetD47_1: D47.1 R105.2
NetD48_1: D48.1 R106.2
NetD49_1: D49.1 R110.2
NetD50_1: D50.1 R120.2
NetD51_1: D51.1 R128.2
NetQ5_D: Q5.D R97.2
NetQ5_G: Q5.G R99.2 R100.2
NetQ6_G: Q6.G R96.2 R98.2
NetQ7_D: Q7.D R107.2
NetQ7_G: Q7.G R108.2 R109.2
NetQ8_D: Q8.D R115.2
NetQ8_G: Q8.G R118.2 R119.2
NetQ9_D: Q9.D R116.1
NetQ9_G: Q9.G R111.2 R113.2
NetQ10_D: Q10.D R117.1
NetQ10_G: Q10.G R112.2 R114.2
NetQ11_D: Q11.D R121.2
NetQ11_G: Q11.G R126.2 R127.2
NetQ12_D: Q12.D R129.1
NetQ12_G: Q12.G R122.2 R124.2
NetQ13_D: Q13.D R130.1
NetQ13_G: Q13.G R123.2 R125.2

### Notes on the sheet
- External open drain inputs are current limited by 22 Ohms, exept the fan output. Short circuits on any output will probably blow the current limiting resistor. Keep some replacements on hand
- CAUTION:
  working method of LED outputs has changed from UD3.0. They used to be high side controlled, with permanent ground.
  Changed to low side switched since UD3.1 to also allow use of 24V indicators.
  This is only backwards compatible if you used each ground pin on the old connector
- Current rating per relay and LED pin is 150mA. If you need more remove the 22 ohm protection resistor. That increases the rating to (TO BE CALCULATED) mA, but a short might kill the PSOC
- Serial Data
- Current Limit
- Fault
- Interrupter
- Fan pin output current rating:
  - screw terminal 10A
  - plug in header 1A
- (near D43) Relay1
- Relay2
- Relay3
- Relay4
- Fan

### Library data of the parts
D43-D51 = LED: Diode, but it lights up; Supplier 1: Digi-Key; Supplier 2: Digi-Key; Supplier 3: Digi-Key; Supplier 4: Digi-Key; Supplier Part Number 1: 732-4979-1-ND; Supplier Part Number 2: 732-4971-1-ND; Supplier Part Number 3: 732-4966-1-ND; Supplier Part Number 4: 732-4981-1-ND
Q5 Q7-Q13 = Mosfet N: pin to pad: D>3 G>1 S>2; Supplier 1: Digi-Key; Supplier Part Number 1: 1727-5305-1-ND; Supplier 2: Digi-Key; Supplier Part Number 2: 1727-1123-1-ND; Supplier 3: Digi-Key; Supplier 4: Digi-Key; Supplier Part Number 4: T2N7002AKLMCT-ND; Supplier Part Number 3: BSC0906NSATMA1CT-ND; Supplier 5: Digi-Key; Supplier Part Number 5: 1727-4714-1-ND; Supplier 6: Digi-Key; Supplier 7: Digi-Key; Supplier Part Number 6: 497-14572-5-ND; Supplier Part Number 7: IPP180N10N3GXKSA1-ND
Q6 = Mosfet N: pin to pad: D>8+7+6+5 G>4 S>3+2+1; Supplier 1: Digi-Key; Supplier Part Number 1: 1727-5305-1-ND; Supplier 2: Digi-Key; Supplier Part Number 2: 1727-1123-1-ND; Supplier 3: Digi-Key; Supplier 4: Digi-Key; Supplier Part Number 4: T2N7002AKLMCT-ND; Supplier Part Number 3: BSC0906NSATMA1CT-ND; Supplier 5: Digi-Key; Supplier Part Number 5: 1727-4714-1-ND; Supplier 6: Digi-Key; Supplier 7: Digi-Key; Supplier Part Number 6: 497-14572-5-ND; Supplier Part Number 7: IPP180N10N3GXKSA1-ND
R96-R130 = Resistor

## Sheet UD3.1 N+P Gate Driver.SchDoc
size A3; DocumentNumber: 6; SheetNumber: 6; SheetTotal: 7
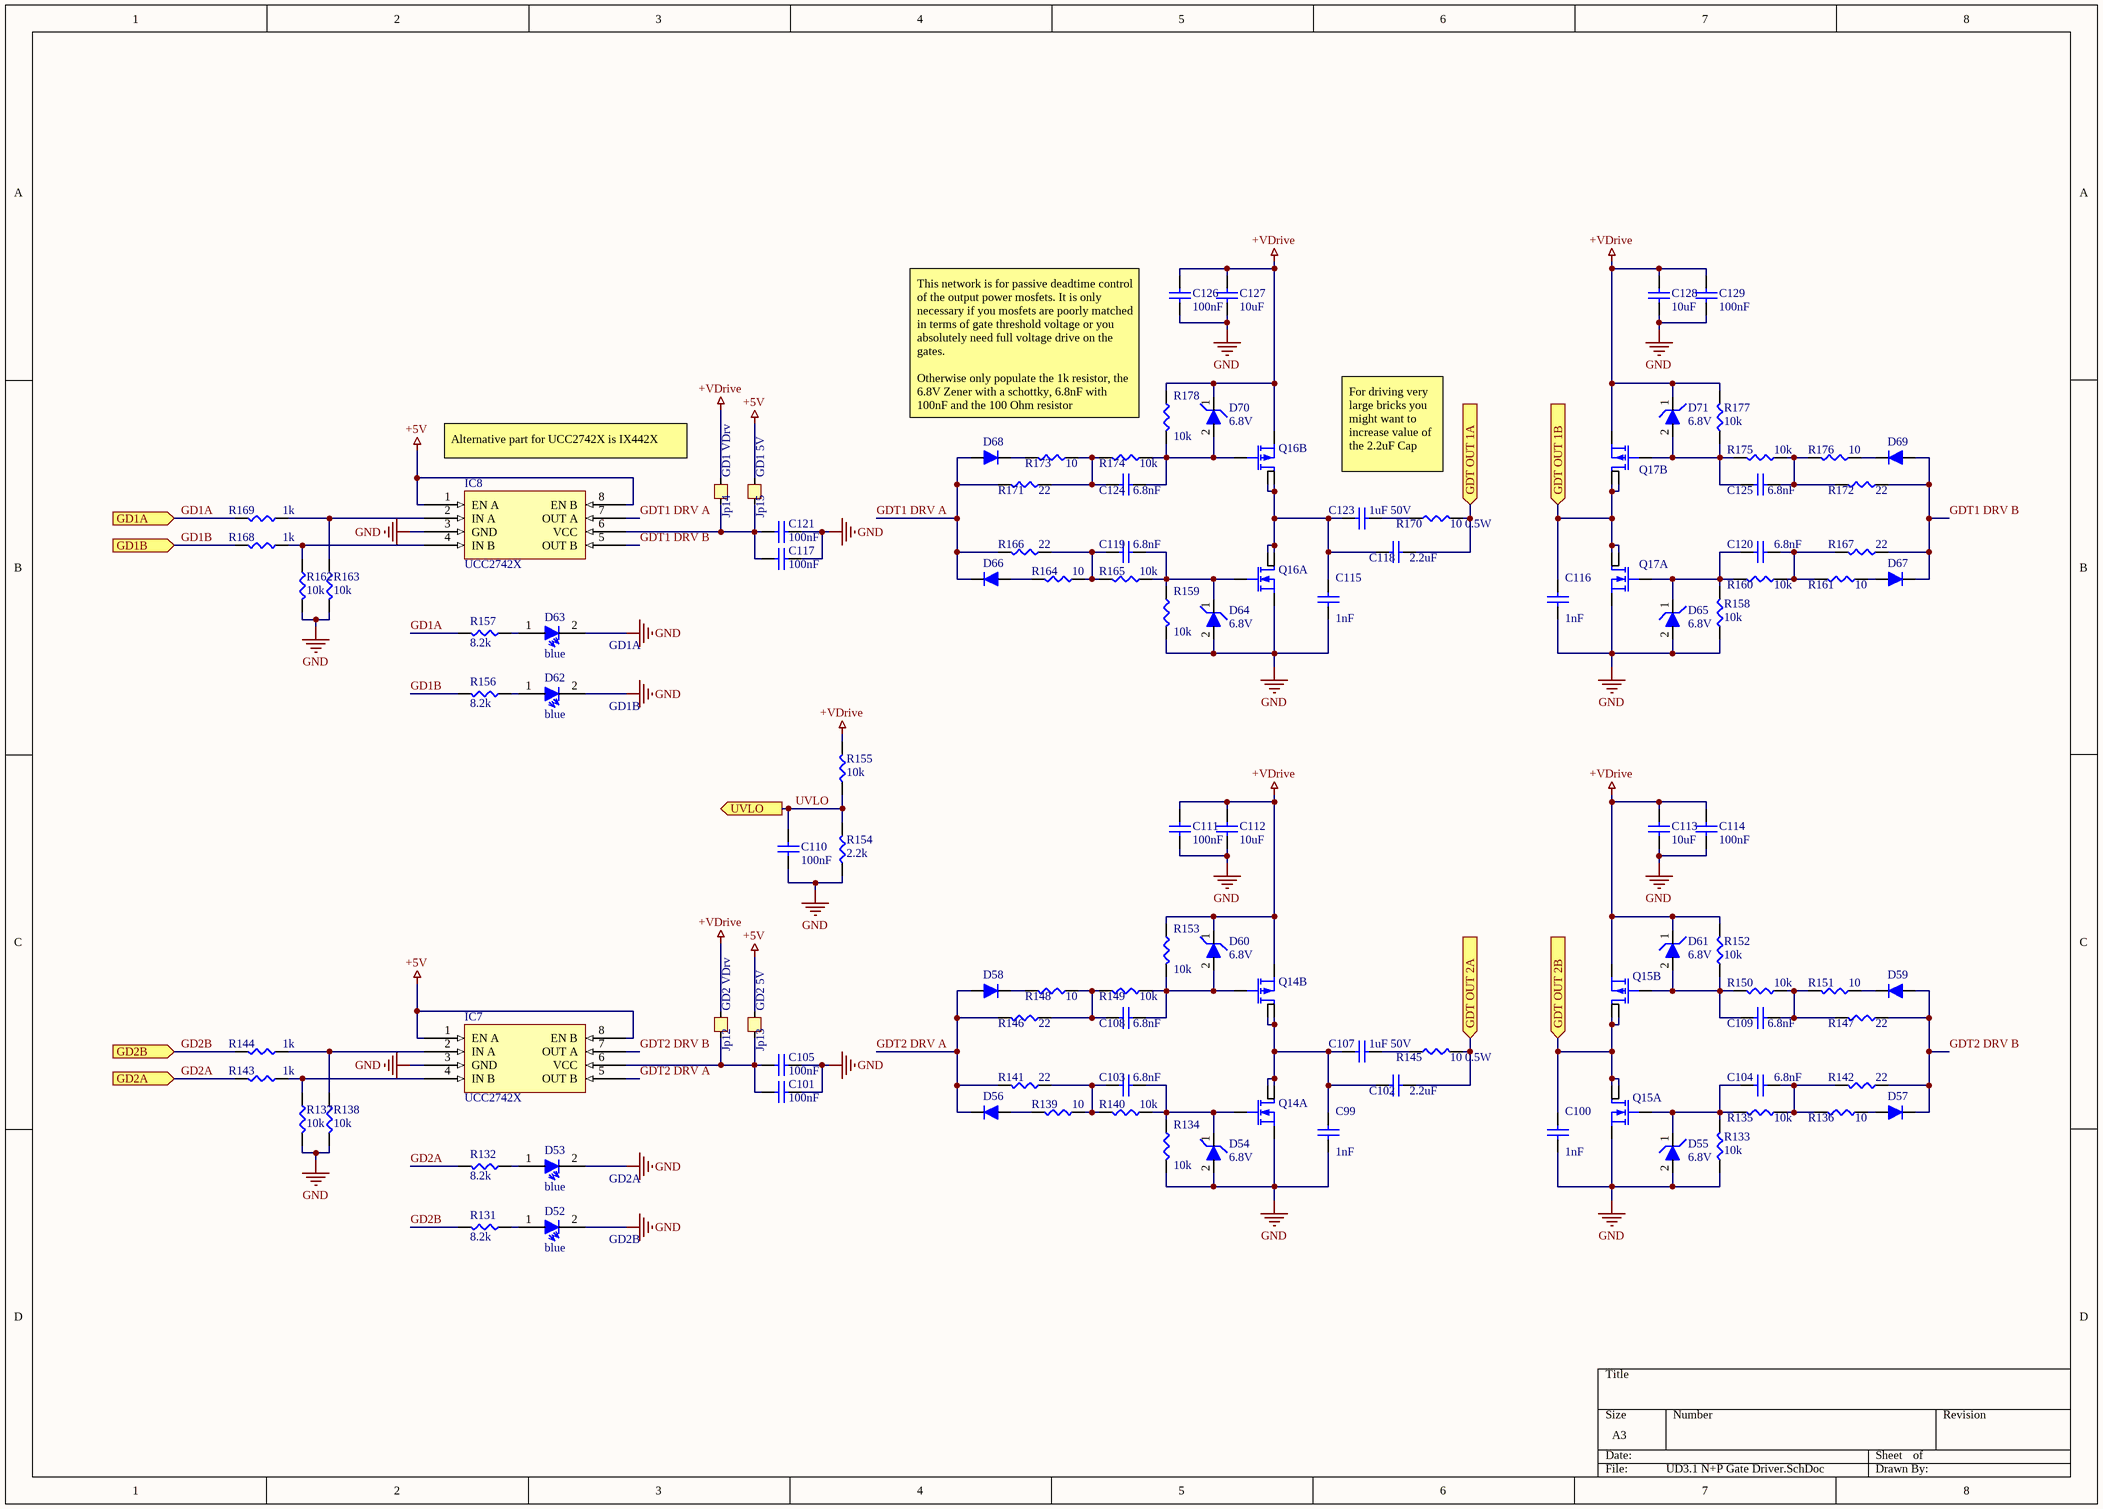
[diagram p4: UD3.1 N+P Gate Driver.SchDoc]

### Parts
C99  1nF  [0603]
C100  1nF  [0603]
C101  100nF  [0603]
C102  2.2uF  [1210]
C103  6.8nF  [0603]
C104  6.8nF  [0603]
C105  100nF  [0603]
C107  1uF 50V  [1210]
C108  6.8nF  [0603]
C109  6.8nF  [0603]
C110  100nF  [0603]
C111  100nF  [0603]
C112  10uF  [0805]
C113  10uF  [0805]
C114  100nF  [0603]
C115  1nF  [0603]
C116  1nF  [0603]
C117  100nF  [0603]
C118  2.2uF  [1210]
C119  6.8nF  [0603]
C120  6.8nF  [0603]
C121  100nF  [0603]
C123  1uF 50V  [1210]
C124  6.8nF  [0603]
C125  6.8nF  [0603]
C126  100nF  [0603]
C127  10uF  [0805]
C128  10uF  [0805]
C129  100nF  [0603]
D52  blue  [1206 Reverse Mount]
D53  blue  [1206 Reverse Mount]
D54  6.8V  [SOD523]
D55  6.8V  [SOD523]
D56  Schottky 30V 100mA  [SOD523]  (value not drawn)
D57  Schottky 30V 100mA  [SOD523]  (value not drawn)
D58  Schottky 30V 100mA  [SOD523]  (value not drawn)
D59  Schottky 30V 100mA  [SOD523]  (value not drawn)
D60  6.8V  [SOD523]
D61  6.8V  [SOD523]
D62  blue  [1206 Reverse Mount]
D63  blue  [1206 Reverse Mount]
D64  6.8V  [SOD523]
D65  6.8V  [SOD523]
D66  Schottky 30V 100mA  [SOD523]  (value not drawn)
D67  Schottky 30V 100mA  [SOD523]  (value not drawn)
D68  Schottky 30V 100mA  [SOD523]  (value not drawn)
D69  Schottky 30V 100mA  [SOD523]  (value not drawn)
D70  6.8V  [SOD523]
D71  6.8V  [SOD523]
IC7  UCC2742X  [SOIC8]
IC8  UCC2742X  [SOIC8]
Jp12  GD2 VDrv  [PCB Jumper NO]
Jp13  GD2 5V  [PCB Jumper NO]
Jp14  GD1 VDrv  [PCB Jumper NO]
Jp15  GD1 5V  [PCB Jumper NO]
Q14  Mosfet 1N1P  [SO-8FL - Dual]  (value not drawn)  (parts A,B of 2)
Q15  Mosfet 1N1P  [SO-8FL - Dual]  (value not drawn)  (parts A,B of 2)
Q16  Mosfet 1N1P  [SO-8FL - Dual]  (value not drawn)  (parts A,B of 2)
Q17  Mosfet 1N1P  [SO-8FL - Dual]  (value not drawn)  (parts A,B of 2)
R131  8.2k  [0603]
R132  8.2k  [0603]
R133  10k  [0603]
R134  10k  [0603]
R135  10k  [0603]
R136  10  [0603]
R137  10k  [0603]
R138  10k  [0603]
R139  10  [0603]
R140  10k  [0603]
R141  22  [0603]
R142  22  [0603]
R143  1k  [0603]
R144  1k  [0603]
R145  10 0.5W  [1210]
R146  22  [0603]
R147  22  [0603]
R148  10  [0603]
R149  10k  [0603]
R150  10k  [0603]
R151  10  [0603]
R152  10k  [0603]
R153  10k  [0603]
R154  2.2k  [0603]
R155  10k  [0603]
R156  8.2k  [0603]
R157  8.2k  [0603]
R158  10k  [0603]
R159  10k  [0603]
R160  10k  [0603]
R161  10  [0603]
R162  10k  [0603]
R163  10k  [0603]
R164  10  [0603]
R165  10k  [0603]
R166  22  [0603]
R167  22  [0603]
R168  1k  [0603]
R169  1k  [0603]
R170  10 0.5W  [1210]
R171  22  [0603]
R172  22  [0603]
R173  10  [0603]
R174  10k  [0603]
R175  10k  [0603]
R176  10  [0603]
R177  10k  [0603]
R178  10k  [0603]

### Ports
GD1A (in), GD1B (in), GD2A (in), GD2B (in), GDT OUT 1A (in), GDT OUT 1B (in), GDT OUT 2A (in), GDT OUT 2B (in), UVLO (out)

### Nets
+5V: IC7.1(EN_A) IC7.8(EN_B) IC8.1(EN_A) IC8.8(EN_B) Jp13.2 Jp15.2
+VDrive: C111.2 C112.2 C113.2 C114.2 C126.2 C127.2 C128.2 C129.2 D60.1 D61.1 D70.1 D71.1 Jp12.2 Jp14.2 Q14.Sp Q15.Sp Q16.Sp Q17.Sp R152.2 R153.2 R155.1 R177.2 R178.2
GND: C99.1 C100.1 C101.2 C105.2 C110.1 C111.1 C112.1 C113.1 C114.1 C115.1 C116.1 C117.2 C121.2 C126.1 C127.1 C128.1 C129.1 D52.2 D53.2 D54.2 D55.2 D62.2 D63.2 D64.2 D65.2 IC7.3(GND) IC8.3(GND) Q14.Sn Q15.Sn Q16.Sn Q17.Sn R133.1 R134.1 R137.1 R138.1 R154.2 R158.1 R159.1 R162.1 R163.1
GD1A: R157.1 R169.1 ; port GD1A
GD1B: R156.1 R168.1 ; port GD1B
GD2A: R132.1 R143.1 ; port GD2A
GD2B: R131.1 R144.1 ; port GD2B
GDT1 DRV A: D66.2 D68.1 IC8.7(OUT_A) R166.1 R171.1
GDT1 DRV B: D67.2 D69.1 IC8.5(OUT_B) R167.1 R172.1
GDT2 DRV A: D56.2 D58.1 IC7.5(OUT_B) R141.1 R146.1
GDT2 DRV B: D57.2 D59.1 IC7.7(OUT_A) R142.1 R147.1
UVLO: C110.2 R154.1 R155.2 ; port UVLO
NetC99_2: C99.2 C102.1 C107.1 Q14.Dn1 Q14.Dn2 Q14.Dp1 Q14.Dp2
NetC100_2: C100.2 Q15.Dn1 Q15.Dn2 Q15.Dp1 Q15.Dp2 ; port GDT OUT 2B
NetC101_1: C101.1 C105.1 IC7.6(VCC) Jp12.1 Jp13.1
NetC102_2: C102.2 R145.2 ; port GDT OUT 2A
NetC103_1: C103.1 R139.2 R140.1 R141.2
NetC103_2: C103.2 D54.1 Q14.Gn R134.2 R140.2
NetC104_1: C104.1 R135.1 R136.2 R142.2
NetC104_2: C104.2 D55.1 Q15.Gn R133.2 R135.2
NetC107_2: C107.2 R145.1
NetC108_1: C108.1 R146.2 R148.2 R149.1
NetC108_2: C108.2 D60.2 Q14.Gp R149.2 R153.1
NetC109_1: C109.1 R147.2 R150.1 R151.2
NetC109_2: C109.2 D61.2 Q15.Gp R150.2 R152.1
NetC115_2: C115.2 C118.1 C123.1 Q16.Dn1 Q16.Dn2 Q16.Dp1 Q16.Dp2
NetC116_2: C116.2 Q17.Dn1 Q17.Dn2 Q17.Dp1 Q17.Dp2 ; port GDT OUT 1B
NetC117_1: C117.1 C121.1 IC8.6(VCC) Jp14.1 Jp15.1
NetC118_2: C118.2 R170.2 ; port GDT OUT 1A
NetC119_1: C119.1 R164.2 R165.1 R166.2
NetC119_2: C119.2 D64.1 Q16.Gn R159.2 R165.2
NetC120_1: C120.1 R160.1 R161.2 R167.2
NetC120_2: C120.2 D65.1 Q17.Gn R158.2 R160.2
NetC123_2: C123.2 R170.1
NetC124_1: C124.1 R171.2 R173.2 R174.1
NetC124_2: C124.2 D70.2 Q16.Gp R174.2 R178.1
NetC125_1: C125.1 R172.2 R175.1 R176.2
NetC125_2: C125.2 D71.2 Q17.Gp R175.2 R177.1
NetD52_1: D52.1 R131.2
NetD53_1: D53.1 R132.2
NetD56_1: D56.1 R139.1
NetD57_1: D57.1 R136.1
NetD58_2: D58.2 R148.1
NetD59_2: D59.2 R151.1
NetD62_1: D62.1 R156.2
NetD63_1: D63.1 R157.2
NetD66_1: D66.1 R164.1
NetD67_1: D67.1 R161.1
NetD68_2: D68.2 R173.1
NetD69_2: D69.2 R176.1
NetIC7_2: IC7.2(IN_A) R138.2 R144.2
NetIC7_4: IC7.4(IN_B) R137.2 R143.2
NetIC8_2: IC8.2(IN_A) R163.2 R169.2
NetIC8_4: IC8.4(IN_B) R162.2 R168.2

### Notes on the sheet
- Alternative part for UCC2742X is IX442X
- This network is for passive deadtime control of the output power mosfets. It is only necessary if you mosfets are poorly matched in terms of gate threshold voltage or you absolutely need full voltage drive on the gates.
  Otherwise only populate the 1k resistor, the 6.8V Zener with a schottky, 6.8nF with 100nF and the 100 Ohm resistor
- For driving very large bricks you might want to increase value of the 2.2uF Cap
- (near D63) GD1A
- (near D62) GD1B
- (near D53) GD2A
- (near D52) GD2B

### Library data of the parts
C99-C105 C107-C121 C123-C129 = Cap
  C101 C103-C105 C108 C109 C117 C119-C121 C124 C125: Supplier 1: Digi-Key; Supplier 2: Digi-Key; Supplier 3: Digi-Key; Supplier Part Number 1: 1276-2044-1-ND; Supplier Part Number 2: 1276-1018-1-ND; Supplier Part Number 3: 1276-1182-1-ND; Supplier 4: Digi-Key; Supplier 5: Digi-Key; Supplier 6: Digi-Key; Supplier 7: Digi-Key; Supplier 8: Digi-Key; Supplier 9: Digi-Key; Supplier Part Number 4: 1276-1009-1-ND; Supplier Part Number 5: 1276-1098-1-ND; Supplier Part Number 6: 1276-1119-1-ND; Supplier Part Number 7: 490-12737-1-ND; Supplier Part Number 9: 587-1249-1-ND; Supplier Part Number 8: 1276-1183-1-ND; Supplier 10: Digi-Key; Supplier 11: Digi-Key; Supplier 12: Digi-Key; Supplier 13: Digi-Key; Supplier Part Number 10: 1276-CL10B104KB8NNNLCT-ND; Supplier Part Number 11: 399-1085-1-ND; Supplier Part Number 13: 587-2985-1-ND; Supplier Part Number 12: 1276-1021-1-ND; Supplier 14: Digi-Key; Supplier 15: Digi-Key; Supplier 16: Digi-Key; Supplier 17: Digi-Key; Supplier 18: Digi-Key; Supplier 19: Digi-Key; Supplier Part Number 14: 490-14603-1-ND; Supplier Part Number 15: 311-3700-1-ND; Supplier Part Number 16: 311-1042-1-ND; Supplier Part Number 17: 311-1415-1-ND; Supplier Part Number 19: 587-4321-1-ND; Supplier Part Number 18: 1276-1907-1-ND; Supplier 20: Digi-Key; Supplier 21: Digi-Key; Supplier 22: Digi-Key; Supplier Part Number 20: 1276-6767-1-ND; Supplier Part Number 21: 1276-7060-1-ND; Supplier Part Number 22: 311-1084-1-ND
D52 D53 D62 D63 = LED: Diode, but it lights up; Supplier 1: Digi-Key; Supplier 2: Digi-Key; Supplier 3: Digi-Key; Supplier 4: Digi-Key; Supplier Part Number 1: 732-4979-1-ND; Supplier Part Number 2: 732-4971-1-ND; Supplier Part Number 3: 732-4966-1-ND; Supplier Part Number 4: 732-4981-1-ND
D54 D55 D60 D61 D64 D65 D70 D71 = Diode Zener: Supplier 1: Digi-Key; Supplier Part Number 1: UCLAMP3301HCT-ND
D56-D59 D66-D69 = Diode: Cmon its a diode what more do I need to say?; pin to pad: 1>2 2>1; Supplier 1: Digi-Key; Supplier Part Number 1: MBR10100GOS-ND; Supplier 2: Digi-Key; Supplier Part Number 2: 1655-1504-1-ND
IC7 IC8 = UCC2742X: Dual gate driver
Jp12-Jp15 = Jumper
Q14-Q17 = Mosfet 1N1P: Dual Mosfet, one N & P channel resp.; pin to pad: Dn1>7/8 Dn2>7/8 Dp1>5/6 Dp2>5/6 Gn>2 Gp>4 Sn>1 Sp>3; Supplier 1: Digi-Key
R131-R178 = Resistor

## Sheet UD3.1 Analog IO.SchDoc
size A4; DocumentNumber: 4; SheetNumber: 4; SheetTotal: 7
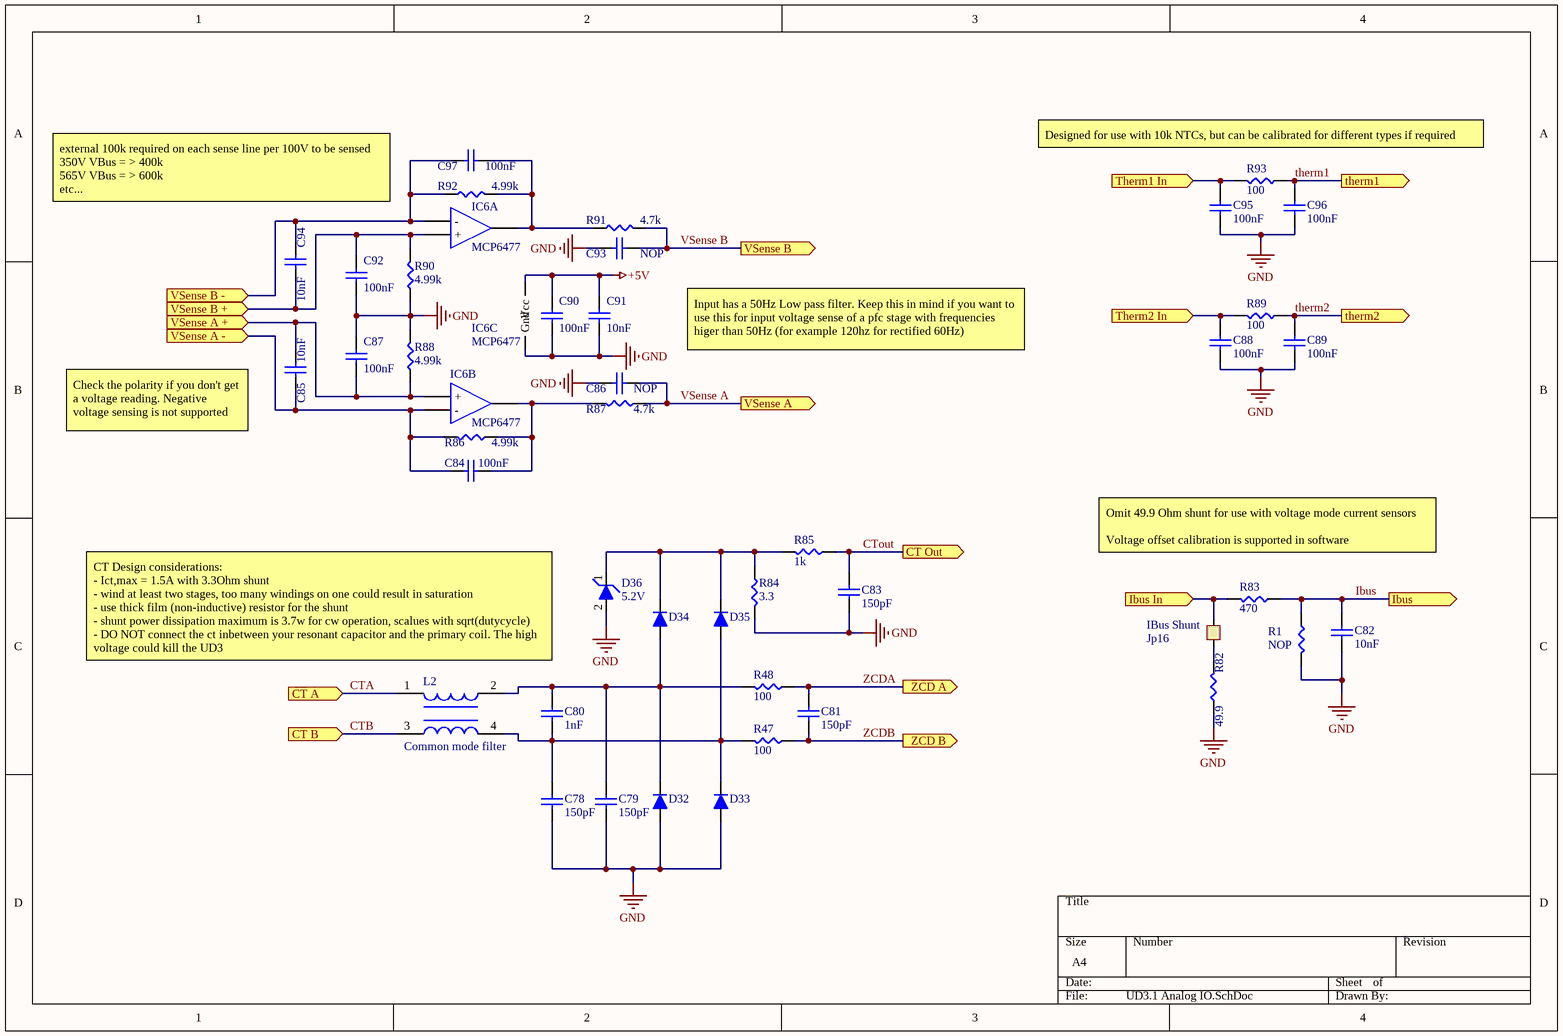
[diagram p5: UD3.1 Analog IO.SchDoc]

### Parts
C78  150pF  [0603]
C79  150pF  [0603]
C80  1nF  [0603]
C81  150pF  [0603]
C82  10nF  [0603]
C83  150pF  [0603]
C84  100nF  [0603]
C85  10nF  [0603]
C86  NOP  [0603]
C87  100nF  [0603]
C88  100nF  [0603]
C89  100nF  [0603]
C90  100nF  [0603]
C91  10nF  [0603]
C92  100nF  [0603]
C93  NOP  [0603]
C94  10nF  [0603]
C95  100nF  [0603]
C96  100nF  [0603]
C97  100nF  [0603]
D32  Schottky 30V 1A  [DO-214]  (value not drawn)
D33  Schottky 30V 1A  [DO-214]  (value not drawn)
D34  Schottky 30V 1A  [DO-214]  (value not drawn)
D35  Schottky 30V 1A  [DO-214]  (value not drawn)
D36  5.2V  [DO-214]
IC6  MCP6477  [soic8]  (parts A,B,C of 3)
Jp16  IBus Shunt  [PCB Jumper NO]
L2  Common mode filter  [SON127P600 4 POS (8.50mm x 5.60mm)]
R1  NOP  [0603]
R47  100  [0603]
R48  100  [0603]
R82  49.9  [1210]
R83  470  [0603]
R84  3.3  [0411 THT 2W]
R85  1k  [0603]
R86  4.99k  [0603]
R87  4.7k  [0603]
R88  4.99k  [0603]
R89  100  [0603]
R90  4.99k  [0603]
R91  4.7k  [0603]
R92  4.99k  [0603]
R93  100  [0603]

### Ports
CT A (in), CT B (in), CT Out (out), Ibus (out), Ibus In (in), therm1 (out), Therm1 In (in), therm2 (out), Therm2 In (in), VSense A (out), VSense A + (in), VSense A - (in), VSense B (out), VSense B + (in), VSense B - (in), ZCD A (out), ZCD B (out)

### Nets
+5V: C90.2 C91.2 IC6.8(Vcc)
GND: C78.2 C79.2 C82.1 C83.2 C86.1 C87.2 C88.1 C89.1 C90.1 C91.1 C92.1 C93.1 C95.1 C96.1 D32.1 D33.1 D36.2 IC6.4(Gnd) R1.2 R82.1 R84.2 R88.2 R90.1
CTA: L2.1 ; port CT A
CTB: L2.3 ; port CT B
CTout: C83.1 R85.1 ; port CT Out
Ibus: C82.2 R1.1 R83.1 ; port Ibus
therm1: C96.2 R93.1 ; port therm1
therm2: C89.2 R89.1 ; port therm2
VSense A: C86.2 R87.2 ; port VSense A
VSense B: C93.2 R91.2 ; port VSense B
ZCDA: C81.1 R48.1 ; port ZCD A
ZCDB: C81.2 R47.1 ; port ZCD B
NetC78_1: C78.1 C80.2 D33.2 D35.1 L2.4 R47.2
NetC79_1: C79.1 C80.1 D32.2 D34.1 L2.2 R48.2
NetC84_1: C84.1 C85.1 IC6.6(-) R86.1 ; port VSense A -
NetC84_2: C84.2 IC6.7(Q) R86.2 R87.1
NetC85_2: C85.2 C87.1 IC6.5(+) R88.1 ; port VSense A +
NetC88_2: C88.2 R89.2 ; port Therm2 In
NetC92_2: C92.2 C94.1 IC6.3(+) R90.2 ; port VSense B +
NetC94_2: C94.2 C97.1 IC6.2(-) R92.1 ; port VSense B -
NetC95_2: C95.2 R93.2 ; port Therm1 In
NetC97_2: C97.2 IC6.1(Q) R91.1 R92.2
NetD34_2: D34.2 D35.2 D36.1 R84.1 R85.2
NetJ16_3: Jp16.2 R83.2 ; port Ibus In
NetJp16_1: Jp16.1 R82.2

### Notes on the sheet
- Designed for use with 10k NTCs, but can be calibrated for different types if required
- external 100k required on each sense line per 100V to be sensed
  350V VBus = > 400k
  565V VBus = > 600k
  etc...
- Input has a 50Hz Low pass filter. Keep this in mind if you want to use this for input voltage sense of a pfc stage with frequencies higer than 50Hz (for example 120hz for rectified 60Hz)
- (near C85) Check the polarity if you don't get a voltage reading. Negative voltage sensing is not supported
- Omit 49.9 Ohm shunt for use with voltage mode current sensors
  Voltage offset calibration is supported in software
  Place 330Ω for R1 when using Current sensor with +/-15V output and watch out for the current direction
- CT Design considerations:
  - Ict,max = 1.5A with 3.3Ohm shunt
  - wind at least two stages, too many windings on one could result in saturation
  - use thick film (non-inductive) resistor for the shunt
  - shunt power dissipation maximum is 3.7w for cw operation, scalues with sqrt(dutycycle)
  - DO NOT connect the ct inbetween your resonant capacitor and the primary coil. The high voltage could kill the UD3

### Library data of the parts
C78-C97 = Cap
D32-D35 = Diode: Cmon its a diode what more do I need to say?; pin to pad: 1>2 2>1; Supplier 1: Digi-Key; Supplier Part Number 1: MBR10100GOS-ND; Supplier 2: Digi-Key; Supplier Part Number 2: 1655-1504-1-ND
D36 = TVS Diode: Supplier 1: Digi-Key; Supplier Part Number 1: UCLAMP3301HCT-ND
IC6 = OpAmp dual: Supplier 1: Digi-Key; Supplier Part Number 1: 296-27903-5-ND
Jp16 = Jumper
L2 = Common mode filter: pin to pad: 2>4 3>2 4>3; Supplier 1: Digi-Key; Supplier Part Number 1: 732-2358-1-ND
R1 R47 R48 R82-R93 = Resistor

## Nets that join several sheets
+5V: UD3.1 (8 pins), UD3.1 Supplies (9 pins), UD3.1 PSOC (21 pins), UD3.1 N+P Gate Driver (6 pins), UD3.1 Analog IO (C90.2 C91.2 IC6.8)
+12V: UD3.1 (Jp11.2), UD3.1 Supplies (7 pins)
+24V: UD3.1 (13 pins), UD3.1 Supplies (13 pins), UD3.1 PSOC (C6.2 J?.1)
+VDrive: UD3.1 Supplies (7 pins), UD3.1 PSOC (J?.9), UD3.1 N+P Gate Driver (23 pins)
-12V: UD3.1 (J16.2), UD3.1 Supplies (C37.2 C38.2 D4.2 U1.5)
GND: UD3.1 (19 pins), UD3.1 Supplies (38 pins), UD3.1 PSOC (32 pins), UD3.1 Digital IO (27 pins), UD3.1 N+P Gate Driver (40 pins), UD3.1 Analog IO (23 pins)
CTA: UD3.1 (J14.1), UD3.1 Analog IO (L2.1)
CTB: UD3.1 (J14.2), UD3.1 Analog IO (L2.3)
CTout: UD3.1 PSOC (MCU1.1), UD3.1 Analog IO (C83.1 R85.1)
DigiPot Clk: UD3.1 Supplies (IC1.4), UD3.1 PSOC (J1.8 MCU1.82)
DigiPot Mosi: UD3.1 Supplies (IC1.5), UD3.1 PSOC (J1.7 MCU1.83)
DigiPot nCS: UD3.1 Supplies (IC1.6), UD3.1 PSOC (J1.6 MCU1.84)
E3.9: UD3.1 Supplies (R13.2 Reg2.8), UD3.1 PSOC (J1.9 MCU1.81)
FAN: UD3.1 PSOC (MCU1.31), UD3.1 Digital IO (R98.1 R105.1)
GD1A: UD3.1 PSOC (J?.5 MCU1.7), UD3.1 N+P Gate Driver (R157.1 R169.1)
GD1B: UD3.1 PSOC (J?.6 MCU1.6), UD3.1 N+P Gate Driver (R156.1 R168.1)
GD2A: UD3.1 PSOC (J?.3 MCU1.9), UD3.1 N+P Gate Driver (R132.1 R143.1)
GD2B: UD3.1 PSOC (J?.4 MCU1.8), UD3.1 N+P Gate Driver (R131.1 R144.1)
Ibus: UD3.1 PSOC (MCU1.80), UD3.1 Analog IO (C82.2 R1.1 R83.1)
LED1: UD3.1 PSOC (MCU1.53), UD3.1 Digital IO (R100.1 R106.1)
LED2: UD3.1 PSOC (MCU1.54), UD3.1 Digital IO (R109.1 R110.1)
LED3: UD3.1 PSOC (MCU1.55), UD3.1 Digital IO (R119.1 R120.1)
LED4: UD3.1 PSOC (MCU1.56), UD3.1 Digital IO (R127.1 R128.1)
NetC84_1: UD3.1 (J17.4), UD3.1 Analog IO (C84.1 C85.1 IC6.6 R86.1)
NetC85_2: UD3.1 (J17.3), UD3.1 Analog IO (C85.2 C87.1 IC6.5 R88.1)
NetC88_2: UD3.1 (J15.3), UD3.1 Analog IO (C88.2 R89.2)
NetC92_2: UD3.1 (J17.1), UD3.1 Analog IO (C92.2 C94.1 IC6.3 R90.2)
NetC94_2: UD3.1 (J17.2), UD3.1 Analog IO (C94.2 C97.1 IC6.2 R92.1)
NetC95_2: UD3.1 (J15.1), UD3.1 Analog IO (C95.2 R93.2)
NetC100_2: UD3.1 (J11.2), UD3.1 N+P Gate Driver (5 pins)
NetC102_2: UD3.1 (J11.1), UD3.1 N+P Gate Driver (C102.2 R145.2)
NetC116_2: UD3.1 (J12.1), UD3.1 N+P Gate Driver (5 pins)
NetC118_2: UD3.1 (J12.2), UD3.1 N+P Gate Driver (C118.2 R170.2)
NetJ16_3: UD3.1 (J16.3), UD3.1 Analog IO (Jp16.2 R83.2)
Relay1: UD3.1 PSOC (MCU1.32), UD3.1 Digital IO (R101.1 R124.1)
Relay1 Out: UD3.1 (D39.1 J21.2), UD3.1 Digital IO (R129.2)
Relay2: UD3.1 PSOC (MCU1.33), UD3.1 Digital IO (R102.1 R125.1)
Relay2 Out: UD3.1 (D40.1 J22.2), UD3.1 Digital IO (R130.2)
Relay3: UD3.1 PSOC (MCU1.27), UD3.1 Digital IO (R103.1 R113.1)
Relay3 Out: UD3.1 (D41.1 J23.2), UD3.1 Digital IO (R116.2)
Relay4: UD3.1 PSOC (MCU1.29), UD3.1 Digital IO (R104.1 R114.1)
Relay4 Out: UD3.1 (D42.1 J24.2), UD3.1 Digital IO (R117.2)
RX: UD3.1 (J10.2), UD3.1 PSOC (MCU1.47)
RXen: UD3.1 (J10.3), UD3.1 PSOC (MCU1.46)
therm1: UD3.1 PSOC (MCU1.96), UD3.1 Analog IO (C96.2 R93.1)
therm2: UD3.1 PSOC (MCU1.95), UD3.1 Analog IO (C89.2 R89.1)
TX: UD3.1 (J10.5), UD3.1 PSOC (MCU1.44)
TXen: UD3.1 (J10.4), UD3.1 PSOC (MCU1.45)
USB D+: UD3.1 (R94.1), UD3.1 PSOC (MCU1.35)
USB D-: UD3.1 (R95.1), UD3.1 PSOC (MCU1.36)
UVLO: UD3.1 PSOC (MCU1.28 MCU1.30), UD3.1 N+P Gate Driver (C110.2 R154.1 R155.2)
VSense A: UD3.1 PSOC (MCU1.72), UD3.1 Analog IO (C86.2 R87.2)
VSense B: UD3.1 PSOC (MCU1.71), UD3.1 Analog IO (C93.2 R91.2)
ZCDA: UD3.1 PSOC (MCU1.3), UD3.1 Analog IO (C81.1 R48.1)
ZCDB: UD3.1 PSOC (MCU1.2), UD3.1 Analog IO (C81.2 R47.1)
⎐ Fan Out: UD3.1 (D38.1 J25.1 J26.1), UD3.1 Digital IO (Q6.D)
⎐ LED1 Out: UD3.1 (J28.1), UD3.1 Digital IO (R97.1)
⎐ LED2 Out: UD3.1 (J20.1), UD3.1 Digital IO (R107.1)
⎐ LED3 Out: UD3.1 (J19.1), UD3.1 Digital IO (R115.1)
⎐ LED4 Out: UD3.1 (J18.1), UD3.1 Digital IO (R121.1)